# EAGLE schematic ic_mega(v1) (EAGLE 9.6.2)
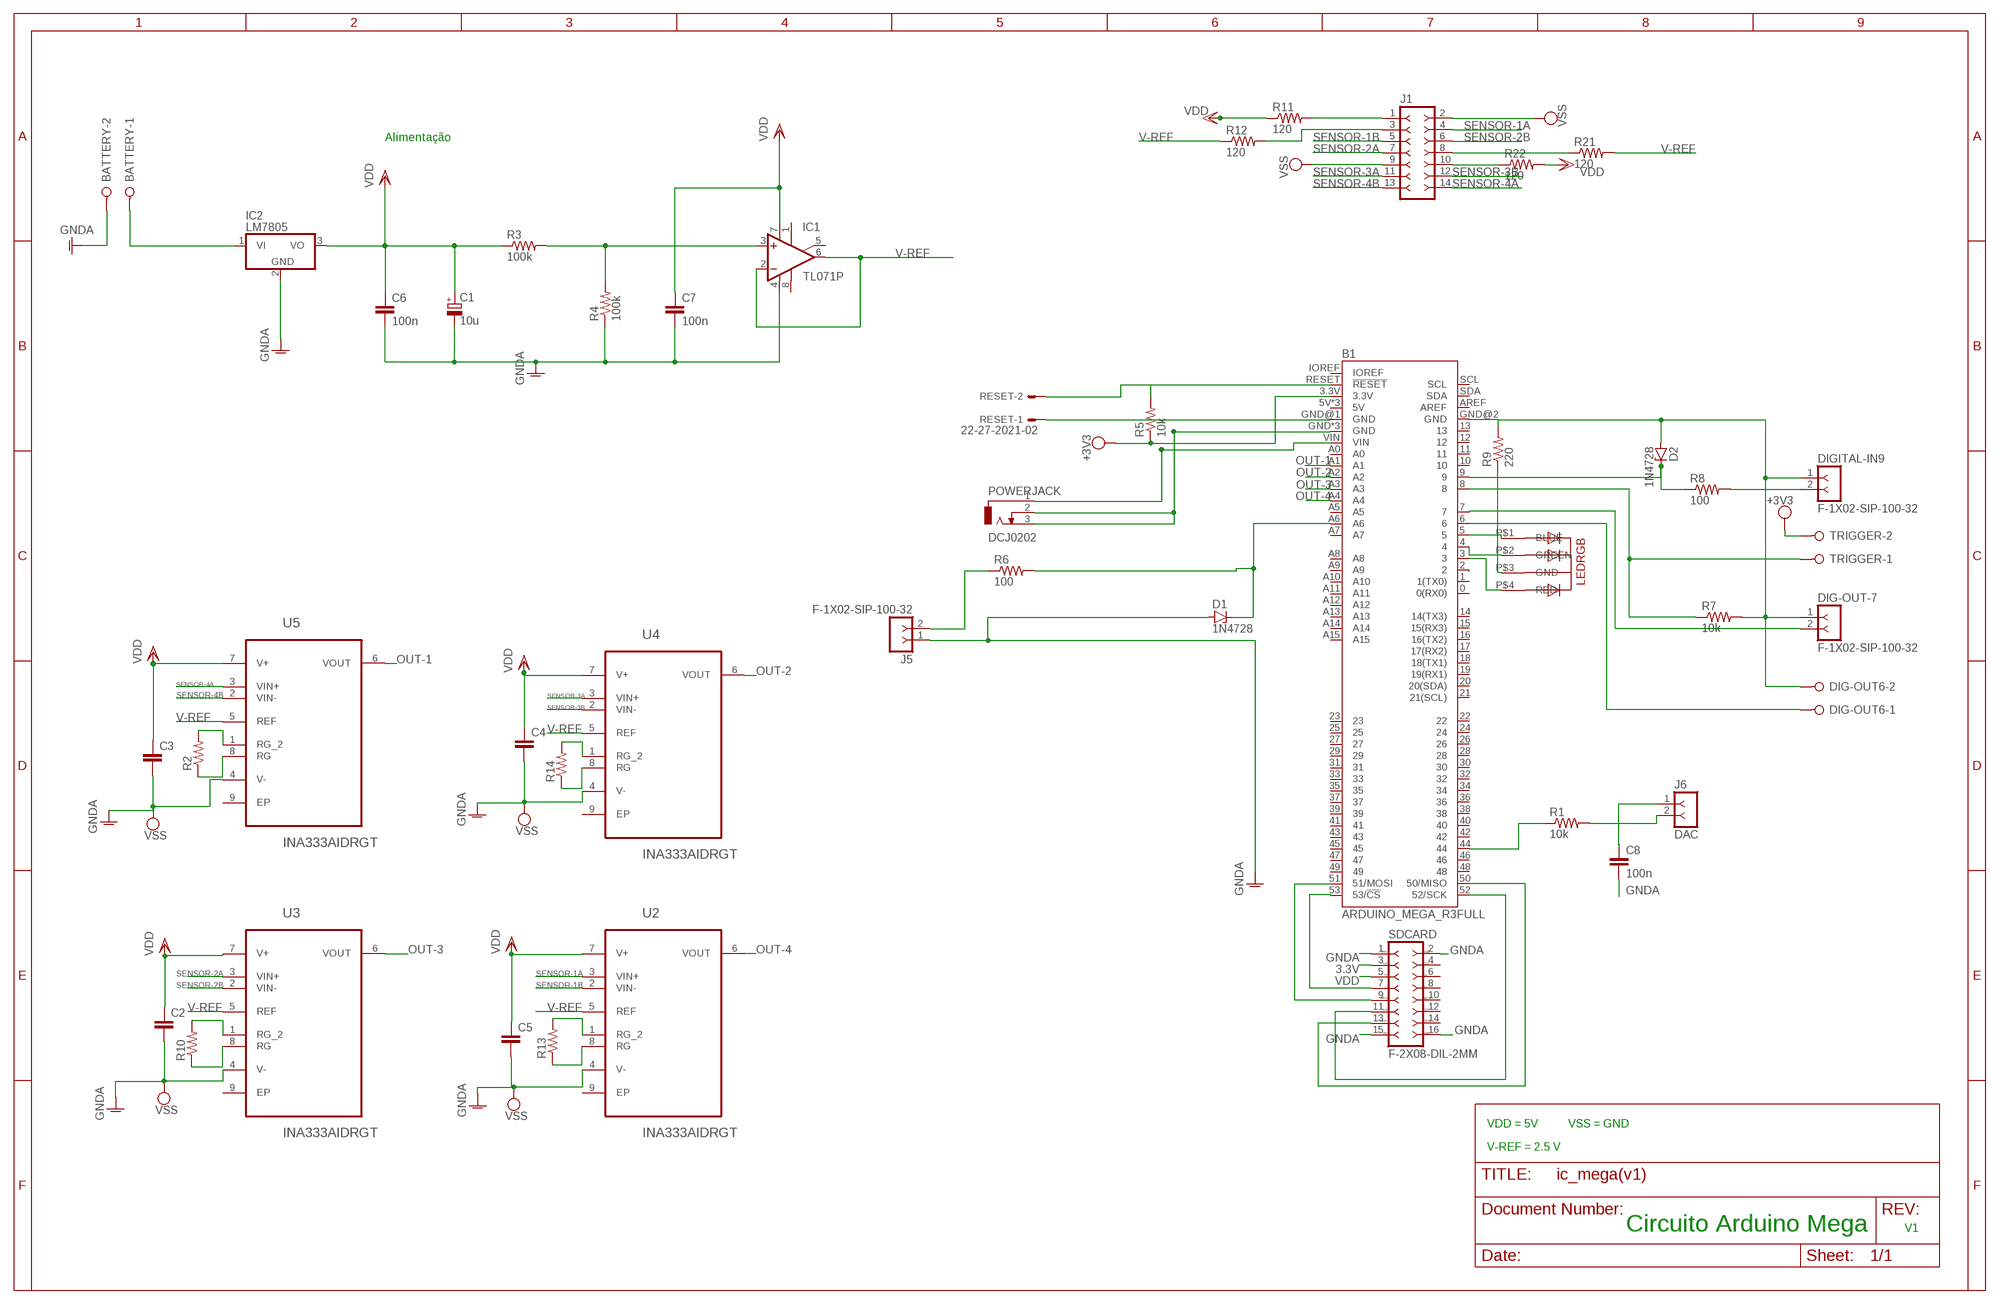
[diagram p0: schematic, sheet 1]

## Parts
B1  ARDUINO_MEGA_R3FULL  [ARDUINO_MEGA_NO_SILK]
BATTERY  W237-02P  [W237-132]
C1  10u  CPOL-EUE2.5-7  [E2,5-7]
C2  C-EU050-030X075  [C050-030X075]
C3  C-EU050-025X075  [C050-025X075]
C4  C-EU050-025X075  [C050-025X075]
C5  C-EU050-025X075  [C050-025X075]
C6  100n  C-EU050-025X075  [C050-025X075]
C7  100n  C-EU050-025X075  [C050-025X075]
C8  100n  C-EU050-025X075  [C050-025X075]
D1  1N4728  [DO41Z10]
D2  1N4728  [DO41Z10]
DIG-OUT6  W237-02P  [W237-132]
DIG-OUT-7  F-1X02-SIP-100-32  [SIP-100-02-32]
DIGITAL-IN9  F-1X02-SIP-100-32  [SIP-100-02-32]
IC1  TL071P  [DIL08]
IC2  LM7805  7818TV  [TO220V]
J1  F-2X07-79107_M  [79107-14_M]
J5  F-1X02-SIP-100-32  [SIP-100-02-32]
J6  DAC  F-1X02-SIP-100-32  [SIP-100-02-32]
LEDRGB  5MMRGBLED  [LED5MMRGB]
POWERJACK  DCJ0202  [DCJ0202]
R1  10k  R-US_0207/10  [0207/10]
R2  R-US_0207/10  [0207/10]
R3  100k  R-US_0207/10  [0207/10]
R4  100k  R-US_0207/10  [0207/10]
R5  10k  R-US_0207/10  [0207/10]
R6  100  R-US_0207/10  [0207/10]
R7  10k  R-US_0207/10  [0207/10]
R8  100  R-US_0207/10  [0207/10]
R9  220  R-US_0207/10  [0207/10]
R10  R-US_0207/10  [0207/10]
R11  120  R-US_0207/10  [0207/10]
R12  120  R-US_0207/10  [0207/10]
R13  R-US_0207/10  [0207/10]
R14  R-US_0207/10  [0207/10]
R21  120  R-US_0207/10  [0207/10]
R22  120  R-US_0207/10  [0207/10]
RESET  22-27-2021-02  [6410-02]
SDCARD  F-2X08-DIL-2MM  [DIL-2MM-2X08]
TRIGGER  W237-02P  [W237-132]
U2  INA333AIDRGT  [SON50P300X300X80-9N]
U3  INA333AIDRGT  [SON50P300X300X80-9N]
U4  INA333AIDRGT  [SON50P300X300X80-9N]
U5  INA333AIDRGT  [SON50P300X300X80-9N]

## Nets
3.3V: SDCARD.3
GNDA: B1.GND B1.GND@1(GND) B1.GND@2(GND) B1.GND@3(GND) B1.GND@4(GND) BATTERY.2 C1.- C2.2 C3.2 C4.2 C5.2 C6.2 C7.2 C8.2 D1.A D2.A DIG-OUT6.2 DIG-OUT-7.1 DIGITAL-IN9.1 IC1.4(V-) IC2.2(GND) J5.1 POWERJACK.2 POWERJACK.3 R4.1 R7.2 R9.2 RESET.1 SDCARD.1 SDCARD.2 SDCARD.15 SDCARD.16 U2.4(V-) U3.4(V-) U4.4(V-) U5.4(V-) ; supply symbol labelled VSS
N$1: B1.RESET(!RESET) R5.2 RESET.2
N$2: BATTERY.1 IC2.1(VI)
N$3: LEDRGB.P$3(GND) R9.1
N$4: IC1.3(+IN) R3.2 R4.2
N$5: B1.A6 D1.C R6.2
N$6: B1.5 LEDRGB.P$1(BLUE)
N$7: R2.2 U5.1(RG_2)
N$8: B1.7 DIG-OUT-7.2
N$9: B1.51(51/MOSI) SDCARD.9
N$10: B1.52(52/SCK) SDCARD.11
N$11: B1.6 DIG-OUT6.1
N$12: B1.9 D2.C R8.1
N$13: B1.4 LEDRGB.P$2(GREEN)
N$14: R2.1 U5.8(RG)
N$15: J1.1 R11.2
N$16: B1.3 LEDRGB.P$4(RED)
N$17: J1.3 R12.2
N$18: B1.44 R1.1
N$19: R14.2 U4.1(RG_2)
N$20: R14.1 U4.8(RG)
N$21: J5.2 R6.1
N$22: R13.2 U2.1(RG_2)
N$23: DIGITAL-IN9.2 R8.2
N$24: R13.1 U2.8(RG)
N$25: B1.53(53/!CS) SDCARD.7
N$26: B1.50(50/MISO) SDCARD.13
N$27: B1.8 R7.1 TRIGGER.1
N$28: R10.2 U3.1(RG_2)
N$29: R10.1 U3.8(RG)
N$30: J1.8 R21.1
N$31: J1.10 R22.1
N$33: B1.VIN POWERJACK.1
N$34: B1.2
N$35: J6.2 R1.2
N$36: C8.1 J6.1
OUT-1: B1.A1 U5.6(VOUT)
OUT-2: B1.A2 U4.6(VOUT)
OUT-3: B1.A3 U3.6(VOUT)
OUT-4: B1.A4 U2.6(VOUT)
SENSOR-1A: J1.4 U2.3(VIN+)
SENSOR-1B: J1.5 U2.2(VIN-)
SENSOR-2A: J1.7 U3.3(VIN+)
SENSOR-2B: J1.6 U3.2(VIN-)
SENSOR-3A: J1.11 U4.3(VIN+)
SENSOR-3B: J1.12 U4.2(VIN-)
SENSOR-4A: J1.14 U5.3(VIN+)
SENSOR-4B: J1.13 U5.2(VIN-)
V-REF: IC1.2(-IN) IC1.6(OUT) R12.1 R21.2 U2.5(REF) U3.5(REF) U4.5(REF) U5.5(REF)
VDD: C1.+ C2.1 C3.1 C4.1 C5.1 C6.1 C7.1 IC1.7(V+) IC2.3(VO) R3.1 R11.1 R22.2 SDCARD.5 U2.7(V+) U3.7(V+) U4.7(V+) U5.7(V+)
VSS: B1.3.3V J1.2 J1.9 R5.1 TRIGGER.2 ; supply symbol labelled +3V3
Unconnected: B1.0(0(RX0)) B1.1(1(TX0)) B1.5V B1.5V@1(5V) B1.5V@2(5V) B1.10 B1.11 B1.12 B1.13 B1.14(14(TX3)) B1.15(15(RX3)) B1.16(16(TX2)) B1.17(17(RX2)) B1.18(18(TX1)) B1.19(19(RX1)) B1.20(20(SDA)) B1.21(21(SCL)) B1.22 B1.23 B1.24 B1.25 B1.26 B1.27 B1.28 B1.29 B1.30 B1.31 B1.32 B1.33 B1.34 B1.35 B1.36 B1.37 B1.38 B1.39 B1.40 B1.41 B1.42 B1.43 B1.45 B1.46 B1.47 B1.48 B1.49 B1.A0 B1.A5 B1.A7 B1.A8 B1.A9 B1.A10 B1.A11 B1.A12 B1.A13 B1.A14 B1.A15 B1.AREF B1.IOREF B1.SCL B1.SDA IC1.1(ON1) IC1.5(ON2) IC1.8(OPT) SDCARD.4 SDCARD.6 SDCARD.8 SDCARD.10 SDCARD.12 SDCARD.14 U2.9(EP) U3.9(EP) U4.9(EP) U5.9(EP)

## Notes on the sheet
- Alimentação
- VDD = 5V | VSS = GND
- V-REF = 2.5 V
- Circuito Arduino Mega | V1

## Library data of the parts
B1 = SparkFun-Boards:ARDUINO_MEGA_R3: Arduino Mega R3 ATmega2560 R3 compatible footprint. SparkFun Products: Arduino Mega 2560 R3 <https://www.sparkfun.com/products/11061>
BATTERY DIG-OUT6 TRIGGER = con-wago-508:W237-02P: WAGO SREW CLAMP; OC_FARNELL: unknown; OC_NEWARK: unknown
C1 = rcl:CPOL-EU: POLARIZED CAPACITOR, European symbol; SPICEPREFIX: C
C2-C8 = rcl:C-EU: CAPACITOR, European symbol; SPICEPREFIX: C
D1 D2 = diode:1N4728: Z DIODE 3.3 V, 1W, 5 percent
DIG-OUT-7 DIGITAL-IN9 J5 J6 = con-headers-jp (1):F-1X02-: FEMALE HEADER
IC1 = TL071:TL071: OP AMP Check availability <https://pricing.snapeda.com/parts/TL071/STMicroelectronics/view-part?ref=eda>; AVAILABILITY: Not in stock; DESCRIPTION: Op Amp Single Low Noise Amplifier ±18V 8-Pin SO N T/R; MF: STMicroelectronics; MP: TL071; PACKAGE: None; PRICE: None
IC2 = linear:78*: Positive VOLTAGE REGULATOR Source: http://cache.national.com/ds/LM/LM78L05.pdf http://www.fairchildsemi.com/ds/LM/LM7805.pdf
J1 = con-headers-jp (1):F-2X07-: FEMALE HEADER
LEDRGB = led_rgb:5MMRGBLED
POWERJACK = con-jack:DCJ0202: DC POWER JACK Source: DCJ0202.pdf; OC_FARNELL: unknown; OC_NEWARK: unknown
R1-R14 R21 R22 = rcl:R-US_: RESISTOR, American symbol; SPICEPREFIX: R
RESET = con-molex:22-?-02: CONNECTOR wire to board 2.54 mm (.1 inch) pitch header; MF: MOLEX; OC_FARNELL: unknown; OC_NEWARK: unknown
SDCARD = con-headers-jp:F-2X08-: FEMALE HEADER
U2-U5 = INA333AIDRGT:INA333AIDRGT: Instrumentation Amplifier Check availability <https://pricing.snapeda.com/parts/INA333AIDRGT/Texas%20Instruments/view-part?ref=eda>; AVAILABILITY: In Stock; DESCRIPTION: Low-Power, Zero-Drift, Precision Instrumentation Amplifier; MF: Texas Instruments; MP: INA333AIDRGT; PACKAGE: WSON-8 Texas Instruments; PRICE: None; PURCHASE-URL: https://pricing.snapeda.com/search?q=INA333AIDRGT&ref=eda